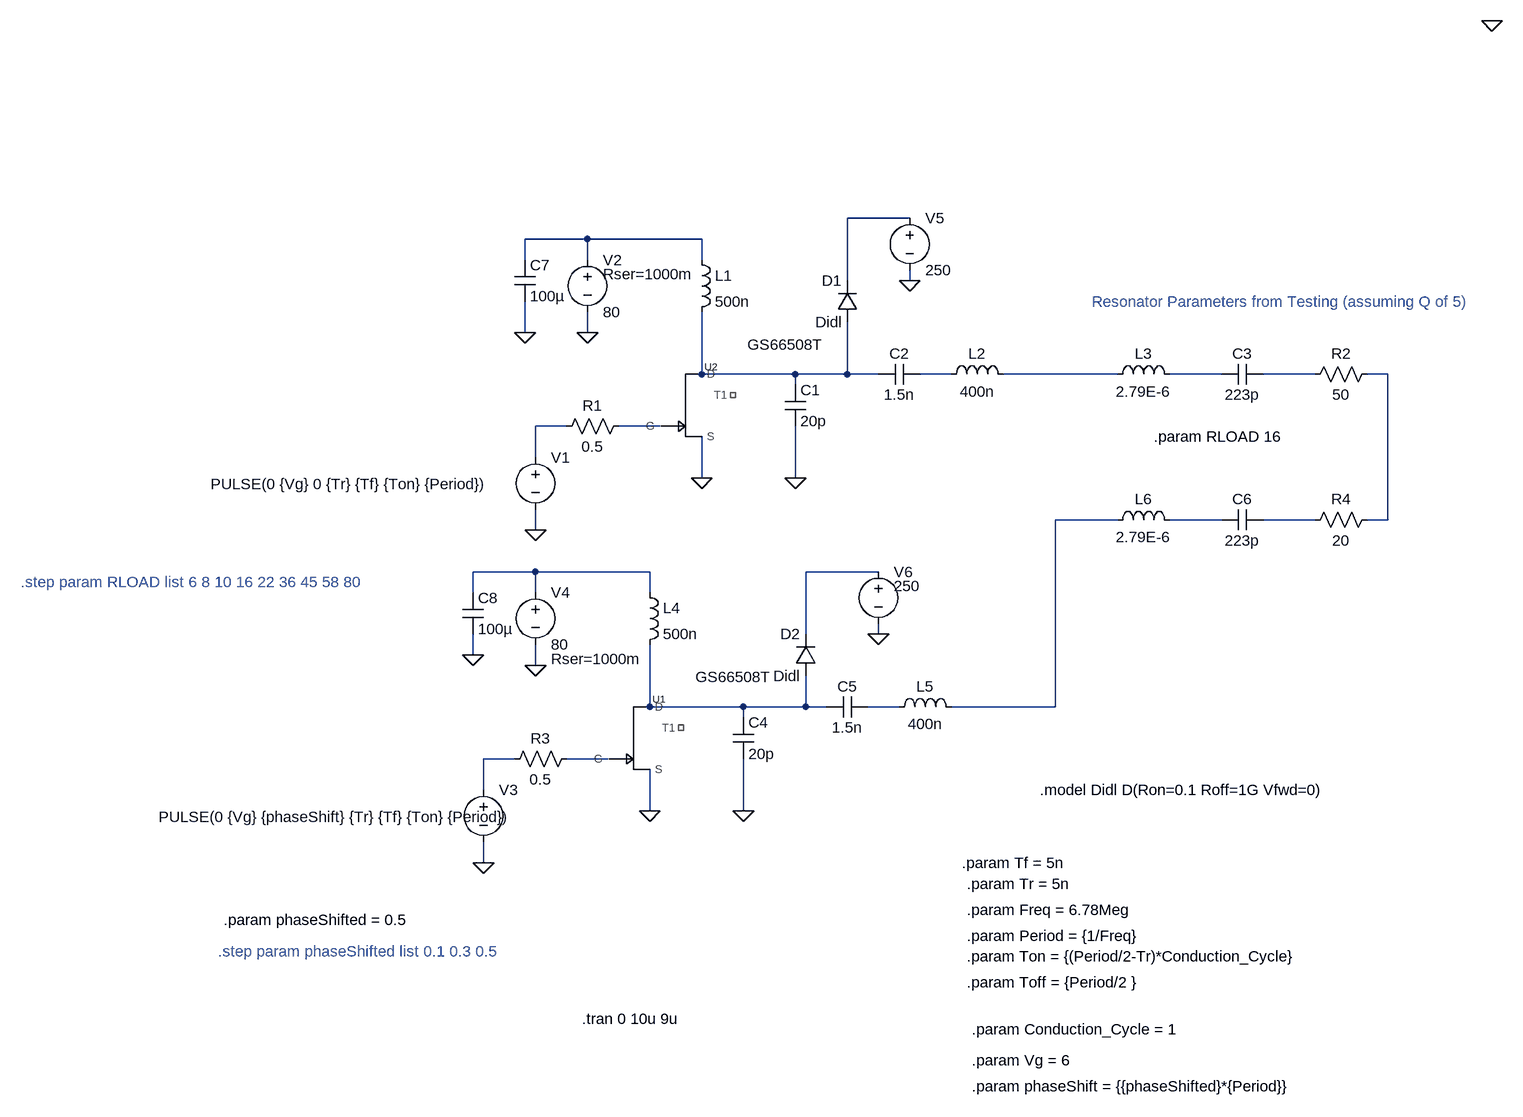
[diagram p0: schematic class_E_modified_outphase.asc]
class_E_modified_outphase.asc, the LTspice schematic file:
Version 4
SHEET 1 900 776
WIRE -80 -576 -176 -576
WIRE -576 -544 -672 -544
WIRE -400 -544 -576 -544
WIRE -672 -512 -672 -544
WIRE -576 -512 -576 -544
WIRE -400 -512 -400 -544
WIRE -176 -480 -176 -576
WIRE -80 -480 -80 -496
WIRE -672 -400 -672 -448
WIRE -576 -400 -576 -432
WIRE -400 -336 -400 -432
WIRE -256 -336 -400 -336
WIRE -176 -336 -176 -416
WIRE -176 -336 -256 -336
WIRE -128 -336 -176 -336
WIRE -16 -336 -64 -336
WIRE 240 -336 64 -336
WIRE 400 -336 320 -336
WIRE 544 -336 464 -336
WIRE 656 -336 624 -336
WIRE -256 -320 -256 -336
WIRE -608 -256 -656 -256
WIRE -464 -256 -528 -256
WIRE -656 -208 -656 -256
WIRE -400 -176 -400 -240
WIRE -256 -176 -256 -256
WIRE 240 -112 144 -112
WIRE 400 -112 320 -112
WIRE 544 -112 464 -112
WIRE 656 -112 656 -336
WIRE 656 -112 624 -112
WIRE -656 -96 -656 -128
WIRE -656 -32 -752 -32
WIRE -480 -32 -656 -32
WIRE -128 -32 -240 -32
WIRE -752 0 -752 -32
WIRE -656 0 -656 -32
WIRE -480 0 -480 -32
WIRE -240 64 -240 -32
WIRE -128 64 -128 48
WIRE -752 96 -752 64
WIRE -656 112 -656 80
WIRE -480 176 -480 80
WIRE -336 176 -480 176
WIRE -240 176 -240 128
WIRE -240 176 -336 176
WIRE -208 176 -240 176
WIRE -96 176 -144 176
WIRE 144 176 144 -112
WIRE 144 176 -16 176
WIRE -336 192 -336 176
WIRE -688 256 -736 256
WIRE -544 256 -608 256
WIRE -736 304 -736 256
WIRE -480 336 -480 272
WIRE -336 336 -336 256
WIRE -736 416 -736 384
FLAG -400 -176 0
FLAG -256 -176 0
FLAG -656 -96 0
FLAG -576 -400 0
FLAG 816 -880 0
FLAG -480 336 0
FLAG -336 336 0
FLAG -736 416 0
FLAG -656 112 0
FLAG -752 96 0
FLAG -672 -400 0
FLAG -128 64 0
FLAG -80 -480 0
SYMBOL voltage -656 -224 R0
WINDOW 3 -500 57 Left 2
WINDOW 123 0 0 Left 2
WINDOW 39 0 0 Left 2
SYMATTR Value PULSE(0 {Vg} 0 {Tr} {Tf} {Ton} {Period})
SYMATTR InstName V1
SYMBOL GaN_E-HEMT_LT_GS66508T -448 -288 R0
SYMATTR InstName U2
SYMBOL ind -416 -528 R0
SYMATTR InstName L1
SYMATTR Value 500n
SYMBOL res -512 -272 R90
WINDOW 0 0 56 VBottom 2
WINDOW 3 32 56 VTop 2
SYMATTR InstName R1
SYMATTR Value 0.5
SYMBOL cap -272 -320 R0
SYMATTR InstName C1
SYMATTR Value 20p
SYMBOL cap -64 -352 R90
WINDOW 0 0 32 VBottom 2
WINDOW 3 32 32 VTop 2
SYMATTR InstName C2
SYMATTR Value 1.5n
SYMBOL ind -32 -320 R270
WINDOW 0 32 56 VTop 2
WINDOW 3 5 56 VBottom 2
SYMATTR InstName L2
SYMATTR Value 400n
SYMBOL voltage -576 -528 R0
WINDOW 123 0 0 Left 2
WINDOW 39 24 38 Left 2
SYMATTR SpiceLine Rser=1000m
SYMATTR InstName V2
SYMATTR Value 80
SYMBOL ind 224 -320 R270
WINDOW 0 32 56 VTop 2
WINDOW 3 5 56 VBottom 2
SYMATTR InstName L3
SYMATTR Value 2.79E-6
SYMBOL cap 464 -352 R90
WINDOW 0 0 32 VBottom 2
WINDOW 3 32 32 VTop 2
SYMATTR InstName C3
SYMATTR Value 223p
SYMBOL res 640 -352 R90
WINDOW 0 0 56 VBottom 2
WINDOW 3 32 56 VTop 2
SYMATTR InstName R2
SYMATTR Value 50
SYMBOL voltage -736 288 R0
WINDOW 3 -500 57 Left 2
WINDOW 123 0 0 Left 2
WINDOW 39 0 0 Left 2
SYMATTR Value PULSE(0 {Vg} {phaseShift} {Tr} {Tf} {Ton} {Period})
SYMATTR InstName V3
SYMBOL GaN_E-HEMT_LT_GS66508T -528 224 R0
SYMATTR InstName U1
SYMBOL ind -496 -16 R0
SYMATTR InstName L4
SYMATTR Value 500n
SYMBOL res -592 240 R90
WINDOW 0 0 56 VBottom 2
WINDOW 3 32 56 VTop 2
SYMATTR InstName R3
SYMATTR Value 0.5
SYMBOL cap -352 192 R0
SYMATTR InstName C4
SYMATTR Value 20p
SYMBOL cap -144 160 R90
WINDOW 0 0 32 VBottom 2
WINDOW 3 32 32 VTop 2
SYMATTR InstName C5
SYMATTR Value 1.5n
SYMBOL ind -112 192 R270
WINDOW 0 32 56 VTop 2
WINDOW 3 5 56 VBottom 2
SYMATTR InstName L5
SYMATTR Value 400n
SYMBOL voltage -656 -16 R0
WINDOW 123 0 0 Left 2
WINDOW 39 24 118 Left 2
SYMATTR SpiceLine Rser=1000m
SYMATTR InstName V4
SYMATTR Value 80
SYMBOL ind 224 -96 R270
WINDOW 0 32 56 VTop 2
WINDOW 3 5 56 VBottom 2
SYMATTR InstName L6
SYMATTR Value 2.79E-6
SYMBOL cap 464 -128 R90
WINDOW 0 0 32 VBottom 2
WINDOW 3 32 32 VTop 2
SYMATTR InstName C6
SYMATTR Value 223p
SYMBOL res 640 -128 R90
WINDOW 0 0 56 VBottom 2
WINDOW 3 32 56 VTop 2
SYMATTR InstName R4
SYMATTR Value 20
SYMBOL cap -688 -512 R0
SYMATTR InstName C7
SYMATTR Value 100µ
SYMATTR SpiceLine Rser=0.01m Lser=0.1n
SYMBOL cap -768 0 R0
SYMATTR InstName C8
SYMATTR Value 100µ
SYMATTR SpiceLine Rser=0.01m Lser=0.1n
SYMBOL diode -160 -416 R180
WINDOW 0 24 64 Left 2
WINDOW 3 24 0 Left 2
SYMATTR InstName D1
SYMATTR Value Didl
SYMBOL diode -224 128 R180
WINDOW 0 24 64 Left 2
WINDOW 3 24 0 Left 2
SYMATTR InstName D2
SYMATTR Value Didl
SYMBOL voltage -80 -592 R0
SYMATTR InstName V5
SYMATTR Value 250
SYMBOL voltage -128 -48 R0
WINDOW 3 24 38 Left 2
SYMATTR InstName V6
SYMATTR Value 250
TEXT 0 416 Left 2 !.param Tf = 5n
TEXT 8 448 Left 2 !.param Tr = 5n
TEXT 8 488 Left 2 !.param Freq = 6.78Meg
TEXT 8 528 Left 2 !.param Period = {1/Freq}
TEXT 8 560 Left 2 !.param Ton = {(Period/2-Tr)*Conduction_Cycle}
TEXT 8 600 Left 2 !.param Toff = {Period/2 }
TEXT -584 656 Left 2 !.tran 0 10u 9u
TEXT 16 672 Left 2 !.param Conduction_Cycle = 1
TEXT 16 720 Left 2 !.param Vg = 6
TEXT -1448 -16 Left 2 ;.step param RLOAD list 6 8 10 16 22 36 45 58 80
TEXT 296 -240 Left 2 !.param RLOAD 16
TEXT 16 760 Left 2 !.param phaseShift = {{phaseShifted}*{Period}}
TEXT 200 -448 Left 2 ;Resonator Parameters from Testing (assuming Q of 5)
TEXT -1144 552 Left 2 ;.step param phaseShifted list 0.1 0.3 0.5
TEXT -1136 504 Left 2 !.param phaseShifted = 0.5
TEXT 120 304 Left 2 !.model Didl D(Ron=0.1 Roff=1G Vfwd=0)

The netlist it stands for:
* class_E_modified_outphase.asc
V1 N009 0 PULSE(0 {Vg} 0 {Tr} {Tf} {Ton} {Period})
XU2 N010 N003 0 NC_01 GS66508T  ; pins G D S T1
L1 N002 N003 500n
R1 N010 N009 0.5
C1 N003 0 20p
C2 N004 N003 1.5n
L2 N004 N005 400n
V2 N002 0 80 Rser=1000m
L3 N005 N006 2.79E-6
C3 N007 N006 223p
R2 N008 N007 50
V3 N018 0 PULSE(0 {Vg} {phaseShift} {Tr} {Tf} {Ton} {Period})
XU1 N019 N016 0 NC_02 GS66508T  ; pins G D S T1
L4 N014 N016 500n
R3 N019 N018 0.5
C4 N016 0 20p
C5 N017 N016 1.5n
L5 N017 N011 400n
V4 N014 0 80 Rser=1000m
L6 N011 N012 2.79E-6
C6 N013 N012 223p
R4 N008 N013 20
C7 N002 0 100µ Rser=0.01m Lser=0.1n
C8 N014 0 100µ Rser=0.01m Lser=0.1n
D1 N003 N001 Didl
D2 N016 N015 Didl
V5 N001 0 250
V6 N015 0 250
.model D D
.lib standard.dio
.param Tf = 5n
.param Tr = 5n
.param Freq = 6.78Meg
.param Period = {1/Freq}
.param Ton = {(Period/2-Tr)*Conduction_Cycle}
.param Toff = {Period/2 }
.tran 0 10u 9u
.param Conduction_Cycle = 1
.param Vg = 6
* .step param RLOAD list 6 8 10 16 22 36 45 58 80
.param RLOAD 16
.param phaseShift = {{phaseShifted}*{Period}}
* Resonator Parameters from Testing (assuming Q of 5)
* .step param phaseShifted list 0.1 0.3 0.5
.param phaseShifted = 0.5
.model Didl D(Ron=0.1 Roff=1G Vfwd=0)
.lib GaN_LTspice_GS66508T_Release1p27.lib
.backanno
.end